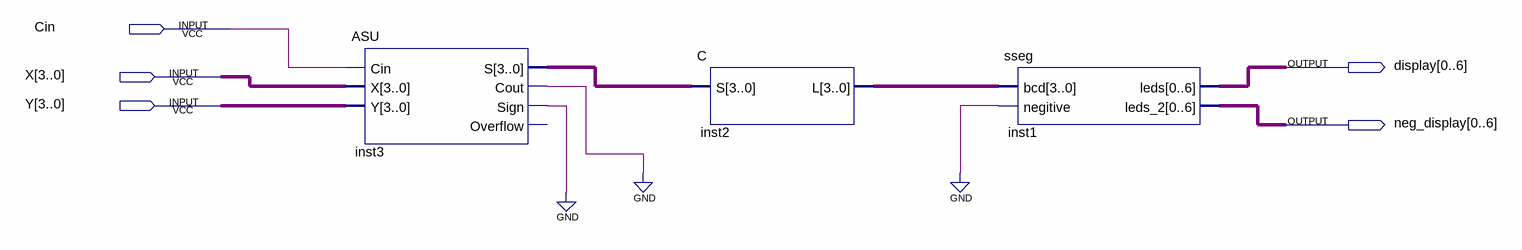
[diagram p0: schematic sheet]
// Quartus schematic CombinedASU2.bdf as structural Verilog: 3 symbols, 5 pins
module CombinedASU2 (
  input  Cin,
  input  [3:0] X,
  input  [3:0] Y,
  output [0:6] display,
  output [0:6] neg_display
);

  wire inst3_cout, inst3_sign;
  wire [3:0] inst2_l, inst3_s;

  ASU inst3 (.Cin(Cin), .X(X), .Y(Y), .S(inst3_s), .Cout(inst3_cout), .Sign(inst3_sign));  // open: Overflow
  C inst2 (.S(inst3_s), .L(inst2_l));
  sseg inst1 (.bcd(inst2_l), .negitive(1'b0), .leds(display), .leds_2(neg_display));
  // also tied to GND on the sheet: {inst3_cout, inst3_sign}
endmodule
